# EAGLE design pre3-auto (EAGLE 5.10)
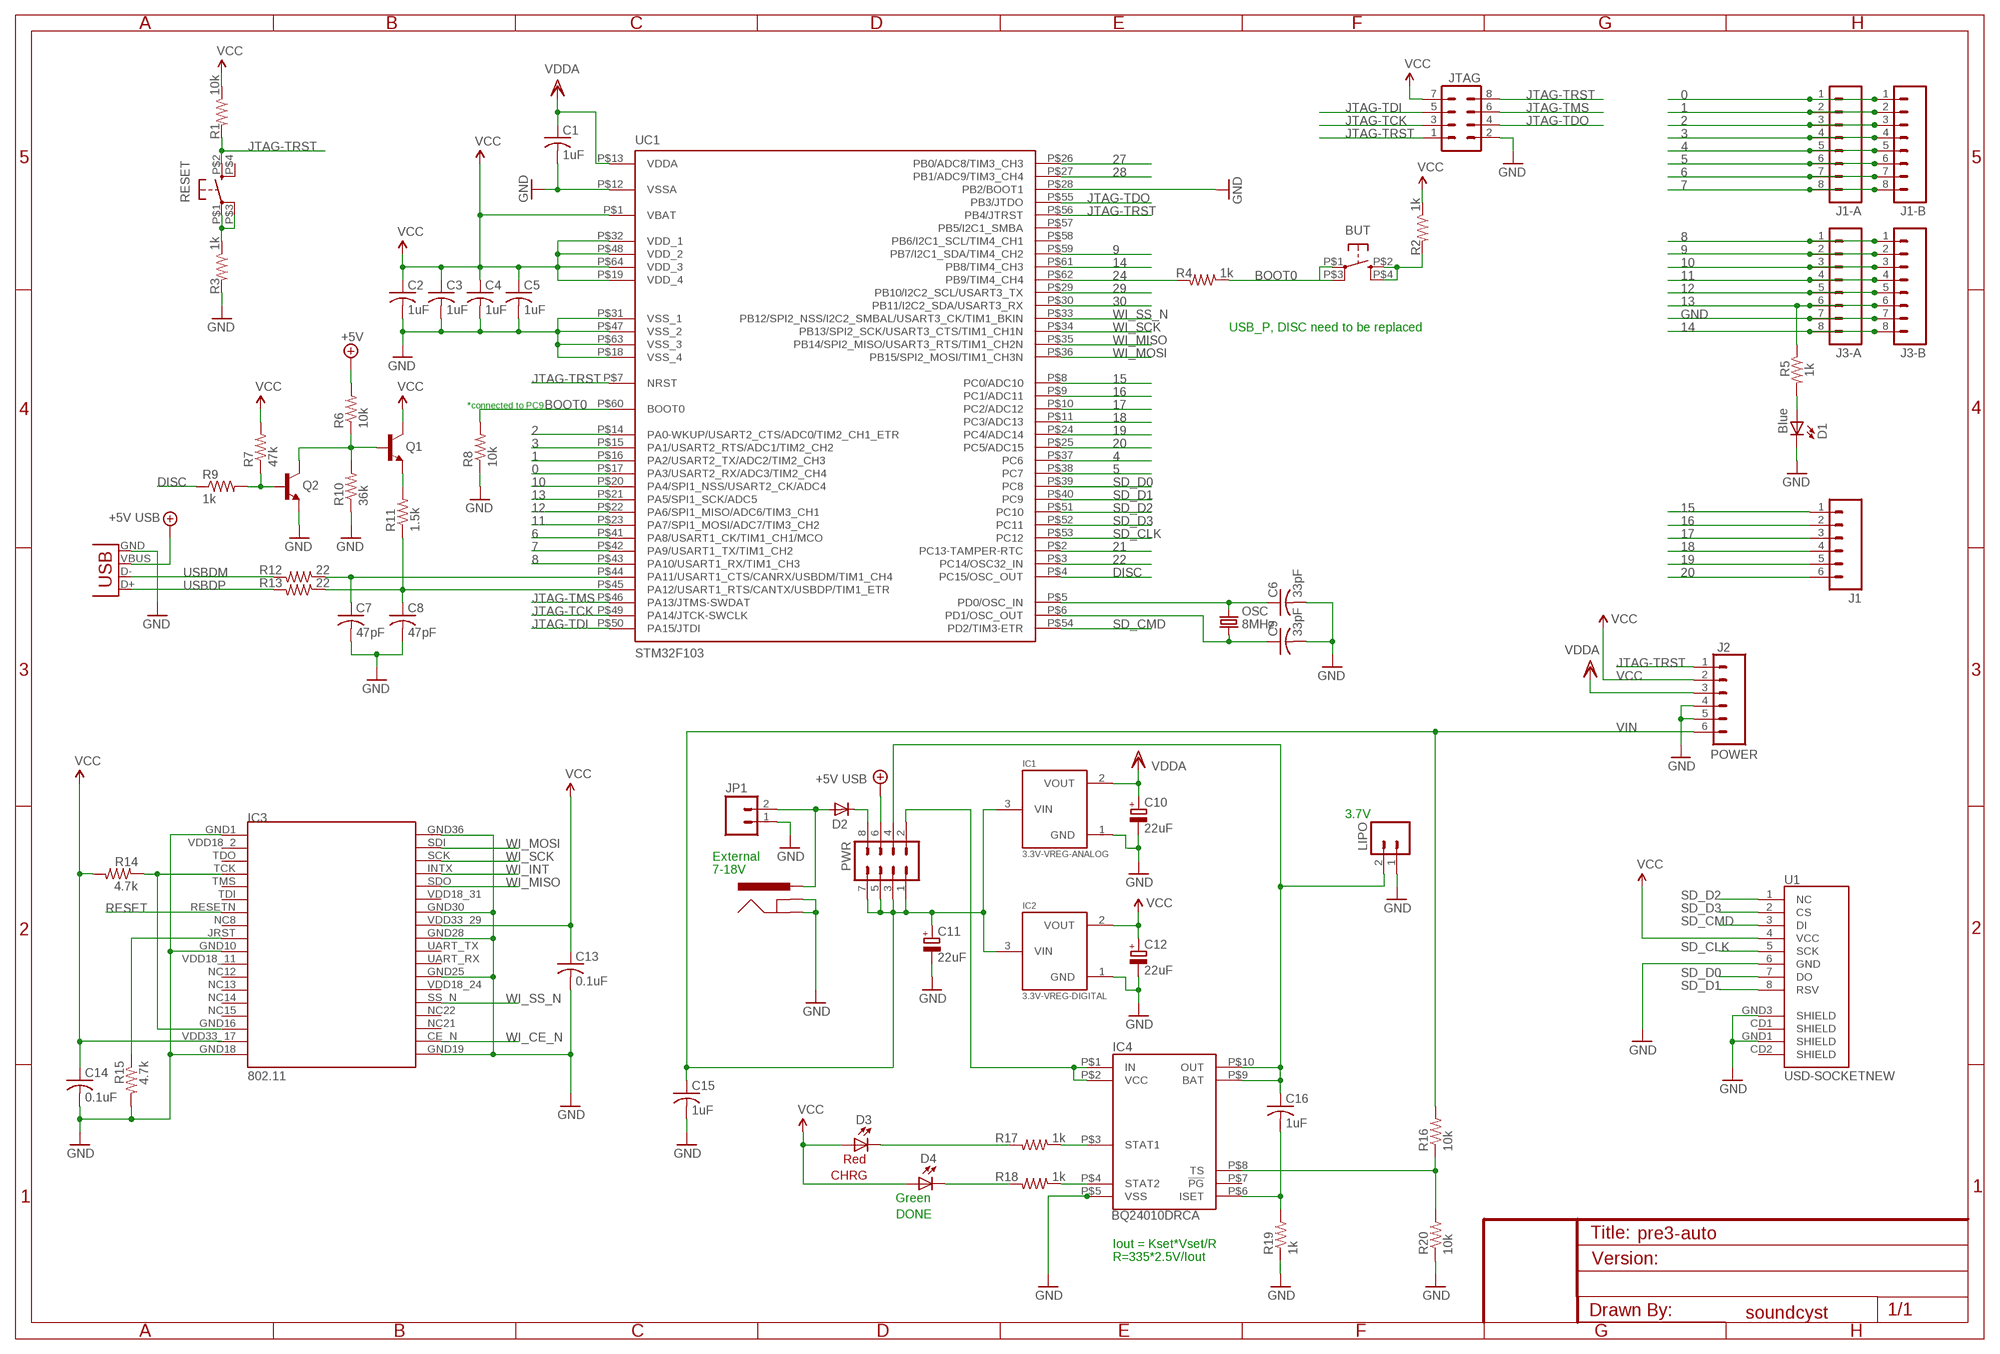
[diagram p0: schematic, sheet 1]

## Parts
BAR  POWER_JACKPTH  [POWER_JACK_PTH]
BUT  BUTTON-KMR241GLFS  [PUSHBUTTON-KMR241GLFS]
C1  1uF  C  [C0603]
C2  1uF  C  [C0603]
C3  1uF  C  [C0603]
C4  1uF  C  [C0603]
C5  1uF  C  [C0603]
C6  33pF  C  [C0603]
C7  47pF  C  [C0603]
C8  47pF  C  [C0603]
C9  33pF  C  [C0603]
C10  22uF  CPOL-EUUD-4X5,8  [UD-4X5,8_NICHICON]
C11  22uF  CPOL-EUUD-4X5,8  [UD-4X5,8_NICHICON]
C12  22uF  CPOL-EUUD-4X5,8  [UD-4X5,8_NICHICON]
C13  0.1uF  C  [C0603]
C14  0.1uF  C  [C0603]
C15  1uF  C  [C0603]
C16  1uF  C  [C0603]
D1  Blue  LED0603  [LED-0603]
D2  DIODE-SOD323-W  [SOD323-W]
D3  Red  LED0603  [LED-0603]
D4  Green  LED0603  [LED-0603]
IC1  3.3V-VREG-ANALOG  MCP1700T  [SOT23]
IC2  3.3V-VREG-DIGITAL  MCP1700T  [SOT23]
IC3  802.11  ZG2100MOD  [ZG2100MOD]
IC4  BQ24010DRCA  [PSON10-V2]
J1  M06SIP  [1X06]
J1-A  M08  [1X08]
J1-B  MA08-SQUARE  [1X08-SQUARE]
J2  POWER  M06SIP  [1X06]
J3-A  M08  [1X08]
J3-B  MA08-SQUARE  [1X08-SQUARE]
JP1  M02PTH  [1X02]
JTAG  MA04-2  [MA04-2]
LIPO  LiPo  M02-JST-2MM-SMT  [S2B-PH]
OSC  8MHz  CRYSTAL5X3  [CRYSTAL-SMD-5X3]
PWR  MA04-2  [MA04-2]
Q1  TRANSISTOR_NPNSOT23  [SOT23]
Q2  TRANSISTOR_NPNSOT23  [SOT23]
R1  10k  R  [R0603]
R2  1k  R  [R0603]
R3  1k  R  [R0603]
R4  1k  R  [R0603]
R5  1k  R  [R0603]
R6  10k  R  [R0603]
R7  47k  R  [R0603]
R8  10k  R  [R0603]
R9  1k  R  [R0603]
R10  36k  R  [R0603]
R11  1.5k  R  [R0603]
R12  22  R  [R0603]
R13  22  R  [R0603]
R14  4.7k  R  [R0603]
R15  4.7k  R  [R0603]
R16  10k  R  [R0603]
R17  1k  R  [R0603]
R18  1k  R  [R0603]
R19  1k  R  [R0603]
R20  10k  R  [R0603]
RESET  BUTTON-KMR241GLFS  [PUSHBUTTON-KMR241GLFS]
U1  USD-SOCKETNEW  [MICRO-SD-SOCKET-PP]
UC1  STM32F103  [TQFP-10X10-64]
X1  USBSMD  [USB-MINIB]

## Nets
0: J1-A.1 J1-B.1 UC1.P$17(PA3/USART2_RX/ADC3/TIM2_CH4)
1: J1-A.2 J1-B.2 UC1.P$16(PA2/USART2_TX/ADC2/TIM2_CH3)
2: J1-A.3 J1-B.3 UC1.P$14(PA0-WKUP/USART2_CTS/ADC0/TIM2_CH1_ETR)
3: J1-A.4 J1-B.4 UC1.P$15(PA1/USART2_RTS/ADC1/TIM2_CH2)
4: J1-A.5 J1-B.5 UC1.P$37(PC6)
5: J1-A.6 J1-B.6 UC1.P$38(PC7)
6: J1-A.7 J1-B.7 UC1.P$41(PA8/USART1_CK/TIM1_CH1/MCO)
7: J1-A.8 J1-B.8 UC1.P$42(PA9/USART1_TX/TIM1_CH2)
8: J3-A.1 J3-B.1 UC1.P$43(PA10/USART1_RX/TIM1_CH3)
9: J3-A.2 J3-B.2 UC1.P$59(PB7/I2C1_SDA/TIM4_CH2)
10: J3-A.3 J3-B.3 UC1.P$20(PA4/SPI1_NSS/USART2_CK/ADC4)
11: J3-A.4 J3-B.4 UC1.P$23(PA7/SPI1_MOSI/ADC7/TIM3_CH2)
12: J3-A.5 J3-B.5 UC1.P$22(PA6/SPI1_MISO/ADC6/TIM3_CH1)
13: J3-A.6 J3-B.6 R5.1 UC1.P$21(PA5/SPI1_SCK/ADC5)
14: J3-A.8 J3-B.8 UC1.P$61(PB8/TIM4_CH3)
15: J1.1 UC1.P$8(PC0/ADC10)
16: J1.2 UC1.P$9(PC1/ADC11)
17: J1.3 UC1.P$10(PC2/ADC12)
18: J1.4 UC1.P$11(PC3/ADC13)
19: J1.5 UC1.P$24(PC4/ADC14)
20: J1.6 UC1.P$25(PC5/ADC15)
21: UC1.P$2(PC13-TAMPER-RTC)
22: UC1.P$3(PC14/OSC32_IN)
24: R4.2 UC1.P$62(PB9/TIM4_CH4)
27: UC1.P$26(PB0/ADC8/TIM3_CH3)
28: UC1.P$27(PB1/ADC9/TIM3_CH4)
29: UC1.P$29(PB10/I2C2_SCL/USART3_TX)
30: UC1.P$30(PB11/I2C2_SDA/USART3_RX)
+5V: PWR.6 R6.2 X1.VBUS ; supply symbol labelled +5V USB
BOOT0: BUT.P$1 BUT.P$3 R4.1 R8.2 UC1.P$60(BOOT0)
DISC: R9.1 UC1.P$4(PC15/OSC_OUT)
GND [vcc]: BAR.GND BAR.GNDBREAK C1.2 C2.2 C3.2 C4.2 C5.2 C6.2 C7.2 C8.2 C9.2 C10.- C11.- C12.- C13.2 C14.2 C15.2 D1.C IC1.1(GND) IC2.1(GND) IC3.GND1 IC3.GND10 IC3.GND18 IC3.GND19 IC3.GND25 IC3.GND28 IC3.GND30 IC3.GND36 IC4.P$5(VSS) J2.4 J2.5 J3-A.7 J3-B.7 JP1.1 JTAG.2 LIPO.1 Q2.2(E) R3.2 R8.1 R10.1 R15.2 R19.1 R20.1 U1.6(GND) U1.GND1(SHIELD) U1.GND3(SHIELD) UC1.P$12(VSSA) UC1.P$18(VSS_4) UC1.P$28(PB2/BOOT1) UC1.P$31(VSS_1) UC1.P$47(VSS_2) UC1.P$63(VSS_3) X1.GND
JTAG-TCK: JTAG.3 UC1.P$49(PA14/JTCK-SWCLK)
JTAG-TDI: JTAG.5 UC1.P$50(PA15/JTDI)
JTAG-TDO: JTAG.4 UC1.P$55(PB3/JTDO)
JTAG-TMS: JTAG.6 UC1.P$46(PA13/JTMS-SWDAT)
JTAG-TRST: J2.1 JTAG.1 JTAG.8 R1.2 RESET.P$2 UC1.P$7(NRST) UC1.P$56(PB4/JTRST)
N$1 [vcc]: BAR.PWR D2.A JP1.2
N$2: C9.1 OSC.1 UC1.P$6(PD1/OSC_OUT)
N$3: IC4.P$8(TS) R16.1 R20.2
N$5: D2.C PWR.8
N$6: C6.1 OSC.3 UC1.P$5(PD0/OSC_IN)
N$7: D1.A R5.2
N$8: Q1.2(E) R11.2
N$9: Q1.1(B) Q2.3(C) R6.1 R10.2
N$10: Q2.1(B) R7.1 R9.2
N$11: C7.1 R12.1 UC1.P$44(PA11/USART1_CTS/CANRX/USBDM/TIM1_CH4)
N$12: C8.1 R11.1 R13.1 UC1.P$45(PA12/USART1_RTS/CANTX/USBDP/TIM1_ETR)
N$13: IC4.P$1(IN) IC4.P$2(VCC) PWR.2
N$16 [vcc]: C16.1 IC4.P$9(BAT) IC4.P$10(OUT) LIPO.2 PWR.4
N$18: IC3.GND16 IC3.TCK R14.1
N$19: C16.2 IC4.P$6(ISET) R19.2
N$20: D4.C R18.2
N$21: D3.C R17.2
N$22: IC4.P$3(STAT1) R17.1
N$23: IC4.P$4(STAT2) R18.1
N$25 [vcc]: R3.1 RESET.P$1 RESET.P$3
N$26: BUT.P$2 BUT.P$4 R2.2
N$27: IC3.JRST R15.1
RESET: IC3.RESETN(RSTN)
SD_CLK: U1.5(SCK) UC1.P$53(PC12)
SD_CMD: U1.3(DI) UC1.P$54(PD2/TIM3-ETR)
SD_D0: U1.7(DO) UC1.P$39(PC8)
SD_D1: U1.8(RSV) UC1.P$40(PC9)
SD_D2: U1.1(NC) UC1.P$51(PC10)
SD_D3: U1.2(CS) UC1.P$52(PC11)
USBDM: R12.2 X1.D-
USBDP: R13.2 X1.D+
VCC: C2.1 C3.1 C4.1 C5.1 C12.+ C13.1 C14.1 D3.A D4.A IC2.2(VOUT) IC3.VDD33_17 IC3.VDD33_29 J2.2 JTAG.7 Q1.3(C) R1.1 R2.1 R7.2 R14.2 U1.4(VCC) UC1.P$1(VBAT) UC1.P$19(VDD_4) UC1.P$32(VDD_1) UC1.P$48(VDD_2) UC1.P$64(VDD_3)
VDD: C1.1 C10.+ IC1.2(VOUT) J2.3 UC1.P$13(VDDA) ; supply symbol labelled VDDA
VIN: C11.+ C15.1 IC1.3(VIN) IC2.3(VIN) J2.6 PWR.1 PWR.3 PWR.5 PWR.7 R16.2
WI_CE_N: IC3.CE_N
WI_INT: IC3.INTX
WI_MISO: IC3.SDO UC1.P$35(PB14/SPI2_MISO/USART3_RTS/TIM1_CH2N)
WI_MOSI: IC3.SDI UC1.P$36(PB15/SPI2_MOSI/TIM1_CH3N)
WI_SCK: IC3.SCK UC1.P$34(PB13/SPI2_SCK/USART3_CTS/TIM1_CH1N)
WI_SS_N: IC3.SS_N UC1.P$33(PB12/SPI2_NSS/I2C2_SMBAL/USART3_CK/TIM1_BKIN)
Unconnected: IC3.NC8 IC3.NC12 IC3.NC13 IC3.NC14 IC3.NC15 IC3.NC21 IC3.NC22 IC3.TDI IC3.TDO IC3.TMS IC3.UART_RX IC3.UART_TX IC3.VDD18_2 IC3.VDD18_11 IC3.VDD18_24 IC3.VDD18_31 IC4.P$7(!PG) RESET.P$4 U1.CD1(SHIELD) U1.CD2(SHIELD) UC1.P$57(PB5/I2C1_SMBA) UC1.P$58(PB6/I2C1_SCL/TIM4_CH1)

## Notes on the sheet
- USB_P, DISC need to be replaced
- *connected to PC9
- 3.7V
- External
- 7-18V
- CHRG
- DONE
- Iout = Kset*Vset/R
- R=335*2.5V/Iout
- soundcyst

## Library data of the parts
BAR = SparkFun2:POWER_JACK: Power Jack This is the standard 5.5mm barrel jack for power. The PTH is the most common, proven, reliable, footprint. All others are experimental. The Slot footprint only works if the mill layer is transmitted to the PCB fab house so be warned. Spark Fun Electronics SKU : PRT-00119. Mating wall wart : TOL-00298 (and others)
BUT RESET = okie:BUTTON-KMR241GLFS
C1-C9 C13-C16 = ReplenishComponentLib:C
C10-C12 = rcl:CPOL-EU: POLARIZED CAPACITOR, European symbol
D1 D3 D4 = SparkFun:LED: LEDs Standard schematic elements and footprints for 5mm, 3mm, 1206, and 0603 sized LEDs. 5mm - Spark Fun Electronics SKU : COM-00529 (and others)
D2 = diode:DIODE-: DIODE
IC1 IC2 = okie:MCP1700T
IC3 = ZGLIB:ZG2100MOD: ZG2100 Module
IC4 = xkn_lib:BQ24010DRC
J1 J2 = SparkFun:M06: Header 6 Standard 6-pin 0.1" header. Use with straight break away headers (SKU : PRT-00116), right angle break away headers (PRT-00553), swiss pins (PRT-00743), machine pins (PRT-00117), and female headers (PRT-00115). Molex polarized connector foot print use with SKU : PRT-08094 with associated crimp pins and housings.
J1-A J3-A = SparkFun:M08: Header 8 Standard 8-pin 0.1" header. Use with straight break away headers (SKU : PRT-00116), right angle break away headers (PRT-00553), swiss pins (PRT-00743), machine pins (PRT-00117), and female headers (PRT-00115).
J1-B J3-B = SparkFun2:MA08-SQUARE
JP1 = SparkFun2:M02: Header 2 Standard 2-pin 0.1" header. Use with straight break away headers (SKU : PRT-00116), right angle break away headers (PRT-00553), swiss pins (PRT-00743), machine pins (PRT-00117), and female headers (PRT-00115). Molex polarized connector foot print use with SKU : PRT-08233 with associated crimp pins and housings.
JTAG PWR = con-lstb:MA04-2: PIN HEADER
LIPO = SparkFun:M02: Header 2 Standard 2-pin 0.1" header. Use with straight break away headers (SKU : PRT-00116), right angle break away headers (PRT-00553), swiss pins (PRT-00743), machine pins (PRT-00117), and female headers (PRT-00115). Molex polarized connector foot print use with SKU : PRT-08233 with associated crimp pins and housings.
OSC = SparkFun2:CRYSTAL: Crystals Various standard crystals. Proven footprints. Spark Fun Electronics SKU : COM-00534
Q1 Q2 = SparkFun2:TRANSISTOR_NPN: Transistor NPN BJT configuration in SOT23 package. MMBT2222 is the common NPN we use. Double check BCE configuration again layout.
R1-R20 = ReplenishComponentLib:R
U1 = SparkFun:USD-SOCKET: microSD Socket Push-push type uSD socket. Schematic element and footprint production proven. Spark Fun Electronics SKU : PRT-00127. tDoc lines correctly indicate media card edge positions when inserting (unlocked, locked, depressed).
UC1 = st-microelectronics:STM32F103
X1 = SparkFun2:USB: USB Connectors USB-B-PTH is fully proven SKU : PRT-00139 USB-miniB is fully proven SKU : PRT-00587 USB-A-PCB is untested. USB-A-H is throughly reviewed, but untested. Spark Fun Electronics SKU : PRT-00437 USB-B-SMT is throughly reviewed, but untested. Needs silkscreen touching up. USB-A-S has not been used/tested USB-MB-H has not been used/tested

## Net classes
0 default: width 0.203 mm, clearance 0.152 mm
1 vcc: width 0.254 mm, clearance 0.152 mm
2 gnd: width 0.305 mm, drill 0.508 mm, clearance 0.152 mm
3 usbvcc: width 0.508 mm, drill 0.508 mm, clearance 0.152 mm

## Board
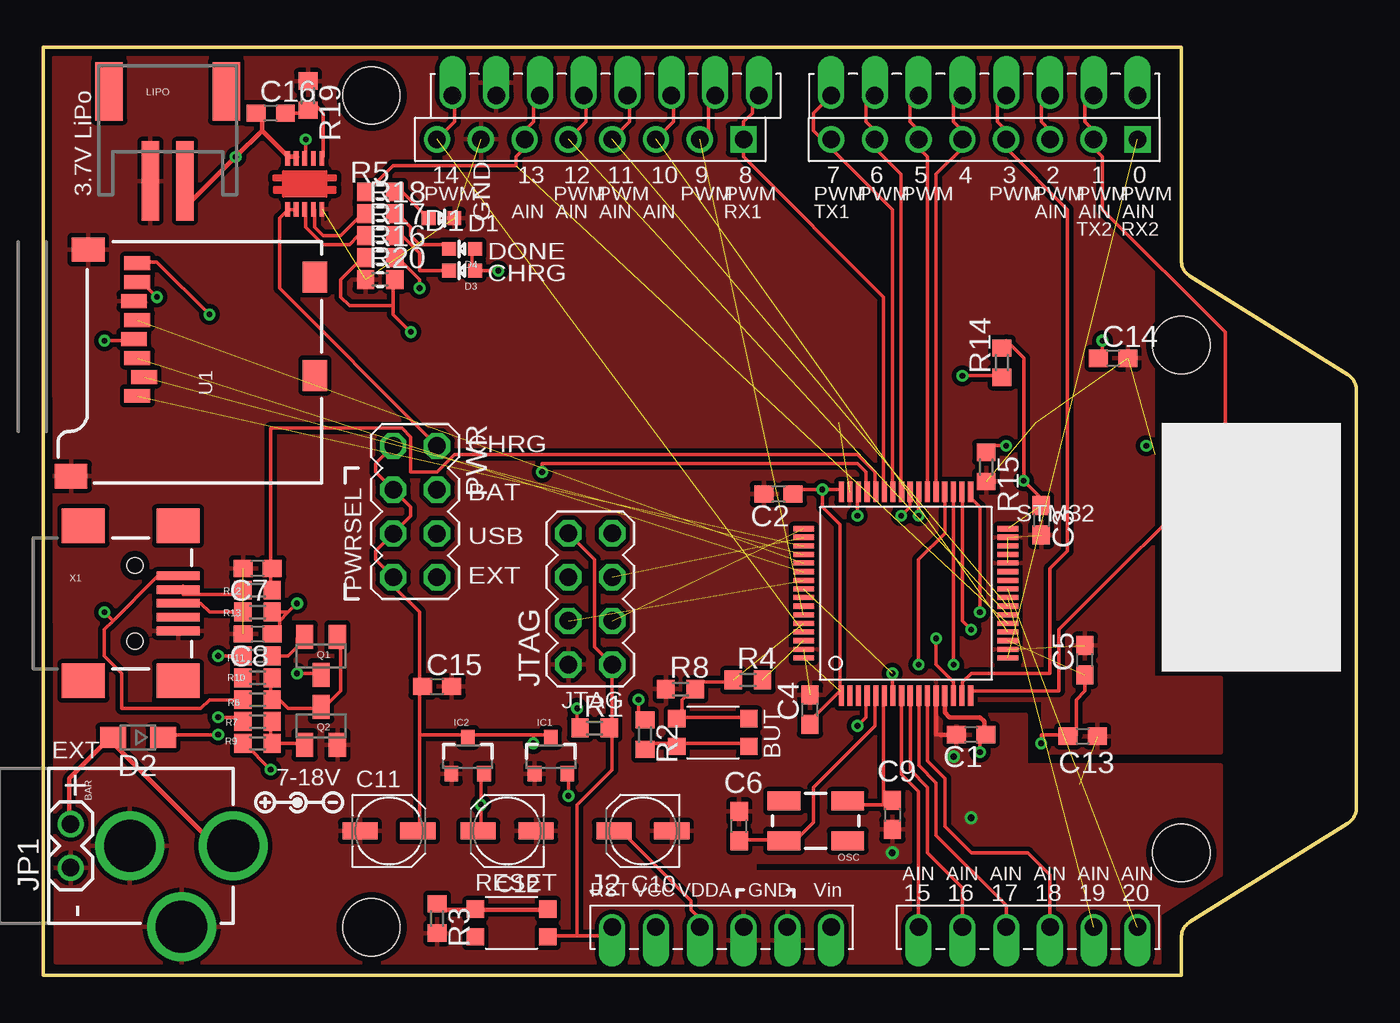
[diagram p1: board, top side]
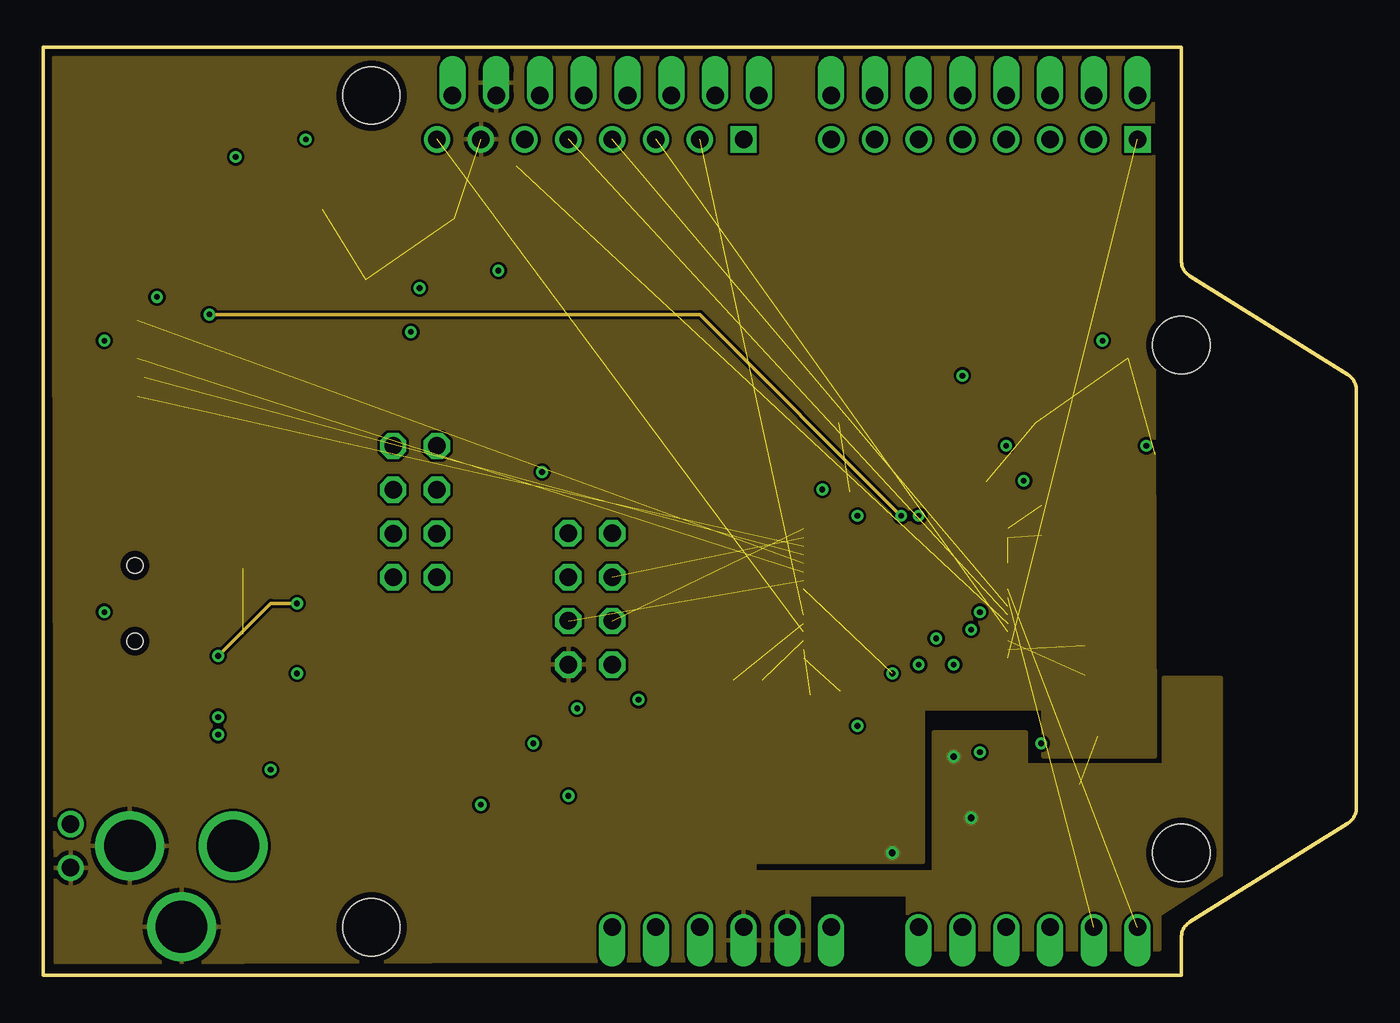
[diagram p2: board, inner layer gndplane]
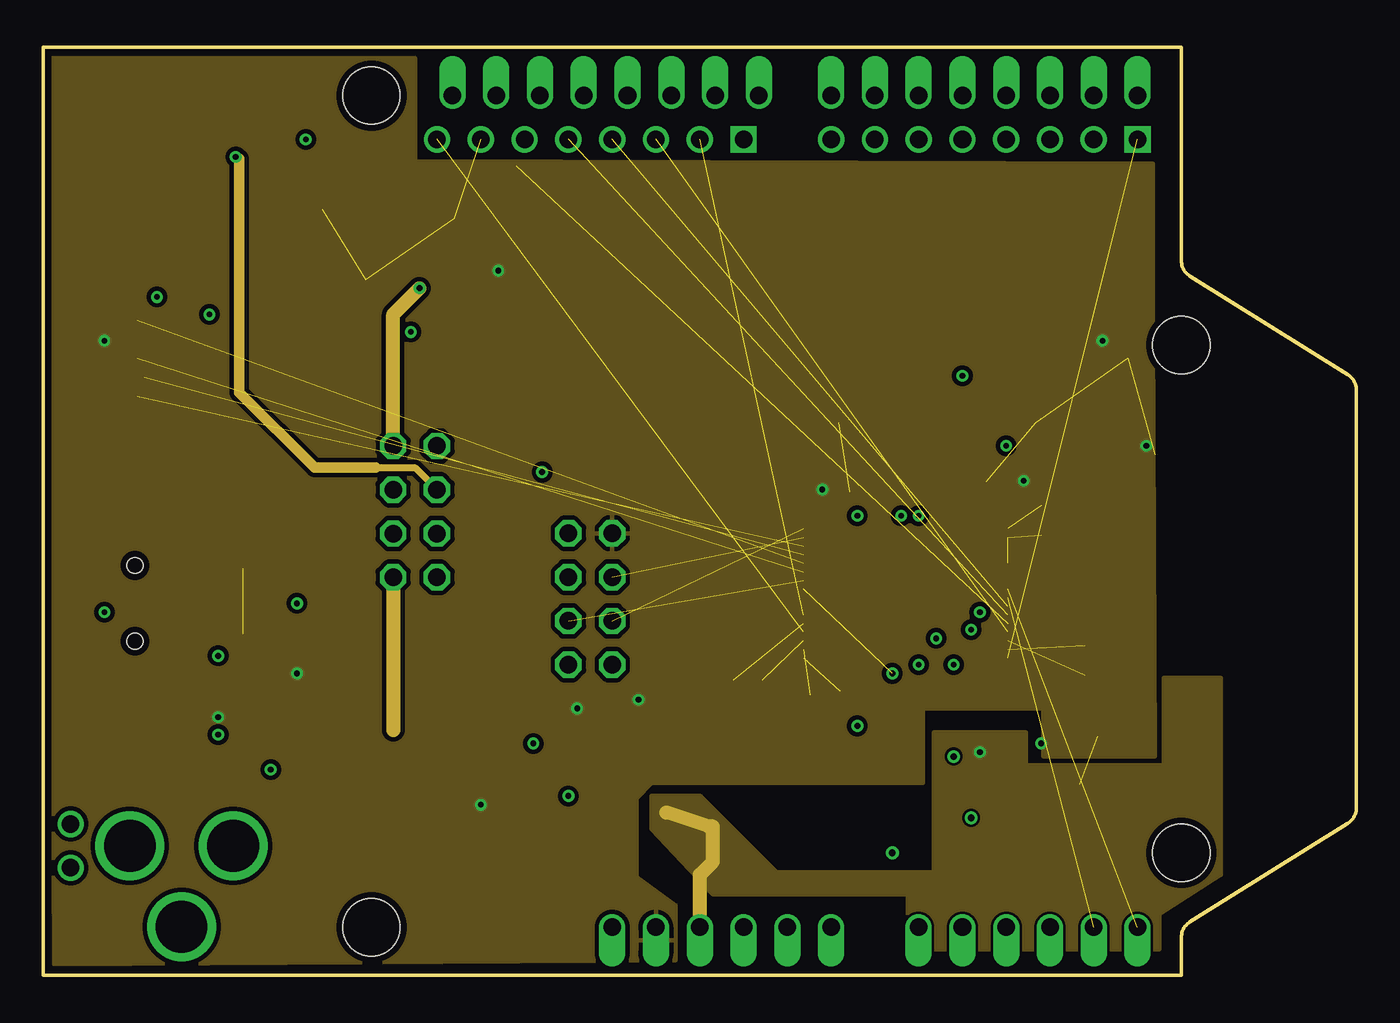
[diagram p3: board, inner layer Route15]
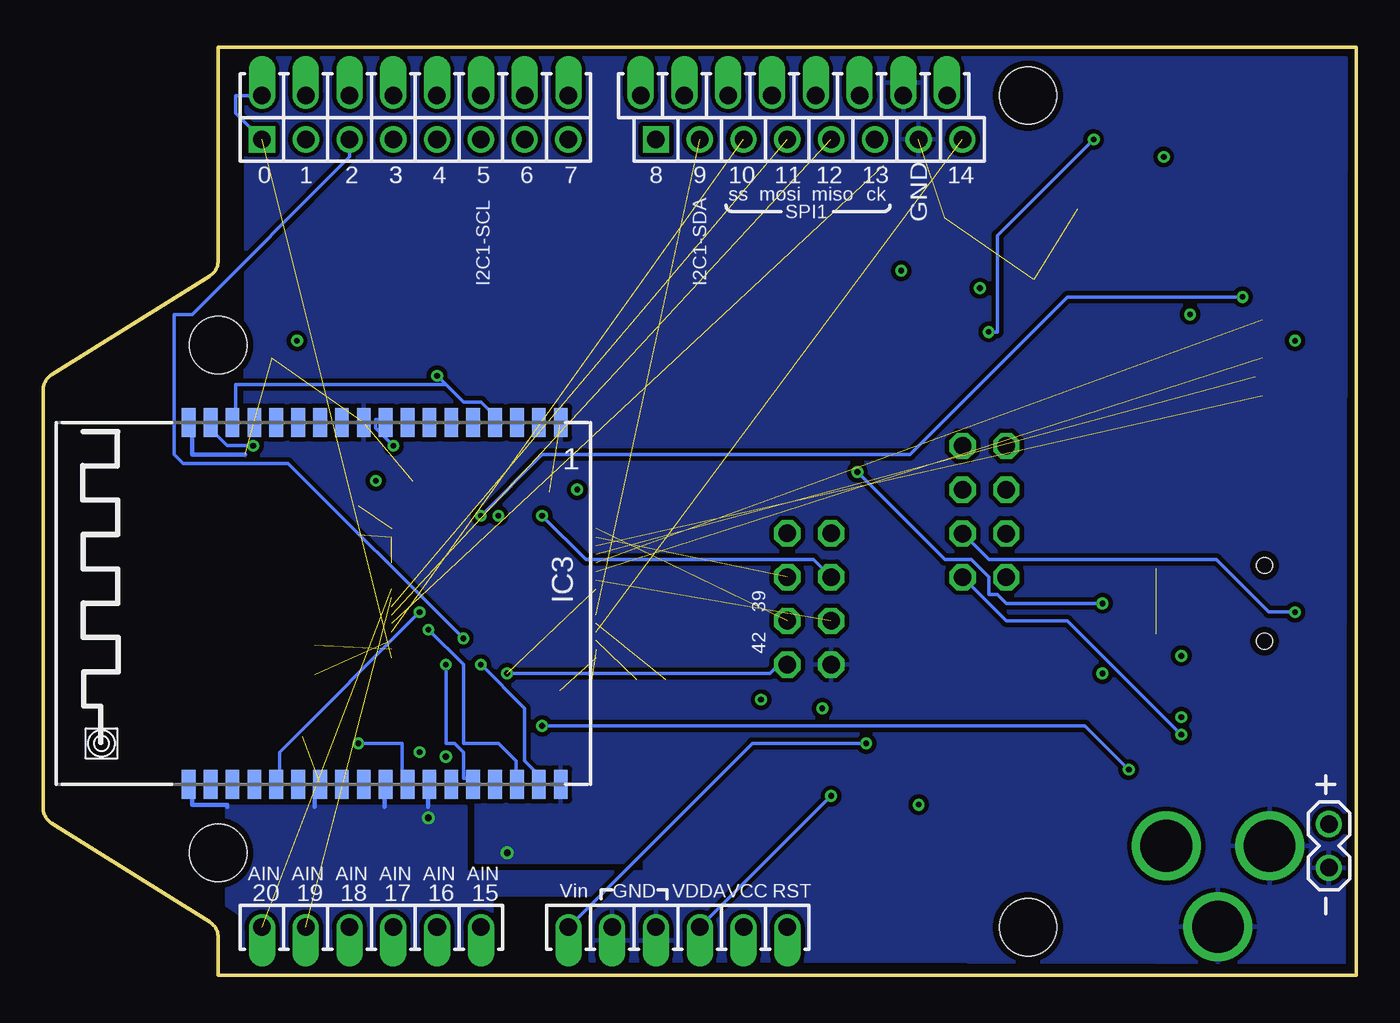
[diagram p4: board, bottom side, seen from below]

Size 76.2 x 53.85 mm. Coordinates in mm from the lower left corner, seen from the top.
Outline: 75.69,8.83 arc58 76.2,9.74 76.2,33.95 arc58 75.69,34.86 66.55,40.58 arc-58 66.04,41.49 66.04,53.85 0,53.85 0,0 66.04,0 66.04,2.2 arc-58 66.55,3.11 75.69,8.83
Copper layers (1*2*15*16): Top 0.0356mm / dielectric 1.5011mm / gndplane 0.0356mm / dielectric 0.1499mm / Route15 0.0356mm / dielectric 0.2007mm / Bottom 0.0356mm
Design rules "LaenPCBOrder *": minimum track width 6mil, minimum drill 13mil, track to track 6mil, track to pad 6mil, pad to pad 6mil, via to via 6mil, smd to smd 6mil, copper to edge 15mil, drill to drill 6mil, minimum pad ring 7mil, minimum via ring 7mil, stop-mask expansion 4mil, vias tented up to drill 0mil, thermal gap 10mil

### Footprints (pad centres in the part's own frame; a part is rotated, then mirrored left to right if it is on the bottom)
POWER_JACK_PTH = drill 2.997 round: GND 0,7.7; GNDBREAK 4.7,10.7; PWR 0,13.7
PUSHBUTTON-KMR241GLFS = smd 1 x 1: P$1 2.1,0.8; P$2 2.1,-0.8; P$3 -2.1,0.8; P$4 -2.1,-0.8
C0603 = smd 1.1 x 1: 1 -0.85,0; 2 0.85,0
UD-4X5,8_NICHICON = smd 2.032 x 1: + 1.679,0; - -1.679,0
LED-0603 = smd 0.8 x 0.8: A 0,-0.75; C 0,0.75
SOD323-W = smd 1.5 x 1.2: A 1.45,0; C -1.45,0
SOT23 = smd 0.8 x 0.9: 1 -0.95,-1; 2 0.95,-1; 3 0,1.1
ZG2100MOD = smd 0.8 x 1.7: CE_N 6.63,10.12; GND1 -13.69,-10.88; GND10 -2.26,-10.88; GND16 5.36,-10.88; GND18 7.9,-10.88; GND19 7.9,10.12; GND25 0.28,10.12; GND28 -3.53,10.12; GND30 -6.07,10.12; GND36 -13.69,10.12; INTX -9.88,10.12; JRST -3.53,-10.88; NC8 -4.8,-10.88; NC12 0.28,-10.88; NC13 1.55,-10.88; NC14 2.82,-10.88; NC15 4.09,-10.88; NC21 5.36,10.12; NC22 4.09,10.12; RESETN -6.07,-10.88; SCK -11.15,10.12; SDI -12.42,10.12; SDO -8.61,10.12; SS_N 2.82,10.12; TCK -9.88,-10.88; TDI -7.34,-10.88; TDO -11.15,-10.88; TMS -8.61,-10.88; UART_RX -0.99,10.12; UART_TX -2.26,10.12; VDD18_2 -12.42,-10.88; VDD18_11 -0.99,-10.88; VDD18_24 1.55,10.12; VDD18_31 -7.34,10.12; VDD33_17 6.63,-10.88; VDD33_29 -4.8,10.12
PSON10-V2 = smd 0.85 x 0.28: P$1 -1.475,1; P$2 -1.475,0.5; P$3 -1.475,0; P$4 -1.475,-0.5; P$5 -1.475,-1; P$6 1.475,-1; P$7 1.475,-0.5; P$8 1.475,0; P$9 1.475,0.5; P$10 1.475,1
1X06 = drill 1.016 offset: 1 0,0; 2 2.54,0; 3 5.08,0; 4 7.62,0; 5 10.16,0; 6 12.7,0
1X08 = drill 1.016 offset: 1 0,0; 2 2.54,0; 3 5.08,0; 4 7.62,0; 5 10.16,0; 6 12.7,0; 7 15.24,0; 8 17.78,0
1X08-SQUARE = drill 1.016 square: 1 -8.89,0 | drill 1.016 round: 2 -6.35,0; 3 -3.81,0; 4 -1.27,0; 5 1.27,0; 6 3.81,0; 7 6.35,0; 8 8.89,0
1X02 = drill 1.016 round: 1 0,0; 2 2.54,0
MA04-2 = drill 1.016 octagon: 1 -3.81,-1.27; 2 -3.81,1.27; 3 -1.27,-1.27; 4 -1.27,1.27; 5 1.27,-1.27; 6 1.27,1.27; 7 3.81,-1.27; 8 3.81,1.27
S2B-PH = smd 1 x 4.6: 1 -1,-3.7; 2 1,-3.7 | smd 1.6 x 3.4: NC1 -3.4,1.5; NC2 3.4,1.5
CRYSTAL-SMD-5X3 = smd 1.9 x 1.1: 1 -1.85,-1.15; 2 1.85,-1.15; 3 1.85,1.15; 4 -1.85,1.15
SOT23' = smd 1 x 1.4: 1 -0.95,-1.1; 2 0.95,-1.1; 3 0,1.1
R0603 = smd 1 x 1.1: 1 -0.85,0; 2 0.85,0
MICRO-SD-SOCKET-PP = smd 0.8 x 1.5: 1 -8.94,10.7; 2 -7.84,10.3; 3 -6.74,10.7; 4 -5.64,10.9; 5 -4.54,10.7; 6 -3.44,10.9; 7 -2.34,10.7; 8 -1.24,10.7 | smd 1.8 x 1.4: CD1 -2.05,0.4; CD2 -7.75,0.4 | smd 1.4 x 1.9: GND1 -13.6,14.55; GND3 -0.45,13.55
STAND-OFF = hole 3.302: 0,0
TQFP-10X10-64 = smd 1.2 x 0.3: P$1 -5.936,3.75; P$2 -5.936,3.25; P$3 -5.936,2.75; P$4 -5.936,2.25; P$5 -5.936,1.75; P$6 -5.936,1.25; P$7 -5.936,0.75; P$8 -5.936,0.25; P$9 -5.936,-0.25; P$10 -5.936,-0.75; P$11 -5.936,-1.25; P$12 -5.936,-1.75; P$13 -5.936,-2.25; P$14 -5.936,-2.75; P$15 -5.936,-3.25; P$16 -5.936,-3.75; P$33 5.886,-3.75; P$34 5.886,-3.25; P$35 5.886,-2.75; P$36 5.886,-2.25; P$37 5.886,-1.75; P$38 5.886,-1.25; P$39 5.886,-0.75; P$40 5.886,-0.25; P$41 5.886,0.25; P$42 5.886,0.75; P$43 5.886,1.25; P$44 5.886,1.75; P$45 5.886,2.25; P$46 5.886,2.75; P$47 5.886,3.25; P$48 5.886,3.75 | smd 0.3 x 1.2: P$17 -3.75,-5.911; P$18 -3.25,-5.911; P$19 -2.75,-5.911; P$20 -2.25,-5.911; P$21 -1.75,-5.911; P$22 -1.25,-5.911; P$23 -0.75,-5.911; P$24 -0.25,-5.911; P$25 0.25,-5.911; P$26 0.75,-5.911; P$27 1.25,-5.911; P$28 1.75,-5.911; P$29 2.25,-5.911; P$30 2.75,-5.911; P$31 3.25,-5.911; P$32 3.75,-5.911; P$49 3.75,5.936; P$50 3.25,5.936; P$51 2.75,5.936; P$52 2.25,5.936; P$53 1.75,5.936; P$54 1.25,5.936; P$55 0.75,5.936; P$56 0.25,5.936; P$57 -0.25,5.936; P$58 -0.75,5.936; P$59 -1.25,5.936; P$60 -1.75,5.936; P$61 -2.25,5.936; P$62 -2.75,5.936; P$63 -3.25,5.936; P$64 -3.75,5.936
USB-MINIB = smd 2.5 x 0.5: D+ 2.5,0; D- 2.5,0.8; GND 2.5,-1.6; ID 2.5,-0.8; VBUS 2.5,1.6 | smd 2.5 x 2: GND@1 -3,-4.5; GND@2 -3,4.5; GND@3 2.5,4.5; GND@4 2.5,-4.5 | hole 0.9: 0,2.2; 0,-2.2

### Placement (x,y rotation side)
BAR  -2.67,7.52 270 top
BUT  38.86,14.1 0 top
C1  53.85,13.97 180 top
C2  42.67,27.94 180 top
C3  57.91,26.42 270 top
C4  44.5,15.42 90 top
C5  60.45,18.29 90 top
C6  40.39,8.66 90 top
C7  12.45,23.62 180 top
C8  12.45,19.81 180 top
C9  49.28,9.32 270 top
C10  34.8,8.38 180 top
C11  20.07,8.38 0 top
C12  26.92,8.38 180 top
C13  60.31,13.88 0 top
C14  62.08,35.81 0 top
C15  22.86,16.76 0 top
C16  13.21,50.04 0 top
D1  23.11,43.94 270 top
D2  5.51,13.82 180 top
D3  24.31,40.89 90 top
D4  24.31,42.16 90 top
IC1  29.46,12.7 0 top
IC2  24.64,12.7 0 top
IC3  59.85,21.21 180 bottom
IC4  15.18,45.93 90 top
J1  50.8,2.79 0 top
J1-A  63.5,51.05 180 top
J1-B  54.61,48.51 180 top
J2  33.02,2.79 0 top
J3-A  41.53,51.05 180 top
J3-B  31.75,48.51 180 top
JP1  1.6,6.25 90 top
JTAG  31.75,21.84 90 top
LIPO  7.23,49.8 0 top
OSC  44.83,8.97 180 top
PWR  21.58,26.91 270 top
Q1  [SOT23']  16.13,18.54 180 top
Q2  [SOT23']  16.13,14.48 0 top
R1  32,14.35 0 top
R2  34.92,13.97 270 top
R3  22.86,3.3 270 top
R4  40.89,17.14 0 top
R5  19.56,45.47 0 top
R6  12.45,16 180 top
R7  12.45,14.73 180 top
R8  36.98,16.61 0 top
R9  12.45,13.46 0 top
R10  12.45,17.27 0 top
R11  12.45,18.54 0 top
R12  12.45,22.35 180 top
R13  12.45,21.08 180 top
R14  55.63,35.56 90 top
R15  54.72,29.51 270 top
R16  19.56,41.66 0 top
R17  19.56,42.93 0 top
R18  19.56,44.2 0 top
R19  15.37,51.05 270 top
R20  19.56,40.39 0 top
RESET  27.18,3.05 0 top
U1  16.17,42.57 90 top
U$1  STAND-OFF  [STAND-OFF]  19.05,2.79 0 top
U$2  STAND-OFF  [STAND-OFF]  66.04,36.58 0 top
U$4  STAND-OFF  [STAND-OFF]  19.05,51.05 0 top
U$10  STAND-OFF  [STAND-OFF]  66.04,7.11 0 top
UC1  50.06,22.17 90 top
X1  5.33,21.59 0 top

### Tracks (layer width: path | path; a pad name or v marks a point on that pad's centre or on a via)
0  (1 unrouted)
  Bottom 0.203: J1-B.1 65.02,50.04 65.02,51.05 J1-A.1
1
  Top 0.203: UC1.P$16 53.85,16.51 58.93,16.51 58.93,20.07 68.58,29.72 68.58,37.34 61.47,44.45 61.47,47.5 60.96,48.01 J1-B.2 60.96,49.02 60.45,49.53 60.45,50.55 J1-A.2
2  (via drill 0.33)
  Top 0.203: v51.82,19.56 51.82,18.03 52.83,17.02 52.83,16.51 UC1.P$14 | J1-A.3 57.91,50.55 57.91,49.53 58.42,49.02 J1-B.3
  Bottom 0.203: v51.82,19.56 61.98,29.72 68.07,29.72 68.58,30.23 68.58,38.35 67.56,38.35 58.42,47.5 J1-B.3
3
  Top 0.203: UC1.P$15 53.34,16.51 53.34,17.02 53.85,17.53 58.42,17.53 58.42,23.62 59.44,24.64 59.44,44.45 55.88,48.01 J1-B.4 55.88,49.02 55.37,49.53 55.37,50.55 J1-A.4
4
  Top 0.203: UC1.P$37 51.82,28.19 51.82,46.48 53.34,48.01 J1-B.5 53.34,49.02 52.83,49.53 52.83,50.55 J1-A.5
5
  Top 0.203: UC1.P$38 51.31,28.19 51.31,47.5 50.8,48.01 J1-B.6 50.8,49.02 50.29,49.53 50.29,50.55 J1-A.6
6
  Top 0.203: UC1.P$41 49.78,28.19 49.78,46.48 48.26,48.01 J1-B.7 48.26,49.02 47.75,49.53 47.75,50.55 J1-A.7
7
  Top 0.203: 45.72,48.01 49.28,44.45 49.28,28.19 UC1.P$42 | J1-A.8 44.7,50.04 44.7,49.02 45.72,48.01 | 45.72,48.01 J1-B.8
8
  Top 0.203: UC1.P$43 48.77,28.19 48.77,39.37 40.64,47.5 J3-B.1 40.64,49.53 41.15,50.04 41.15,51.05 J3-A.1
9  (1 unrouted)
  Top 0.203: J3-B.2 38.61,49.02 38.61,51.05 J3-A.2
10  (1 unrouted)
  Top 0.203: J3-B.3 36.58,49.53 36.58,51.05 J3-A.3
11  (1 unrouted)
  Top 0.203: J3-B.4 34.04,49.53 34.04,51.05 J3-A.4
12  (1 unrouted)
  Top 0.203: J3-B.5 31.5,49.53 31.5,51.05 J3-A.5
13  (1 unrouted)
  Top 0.203: R5.1 18.8,45.47 20.32,46.99 27.43,46.99 27.43,47.5 27.94,48.01 J3-B.6 27.94,49.02 28.45,49.53 28.45,51.05 J3-A.6
14  (1 unrouted)
  Top 0.203: J3-B.8 23.88,49.53 23.88,51.05 J3-A.8
15
  Top 0.203: UC1.P$8 49.81,11.65 50.8,10.67 J1.1
16
  Top 0.203: UC1.P$9 50.31,11.92 51.31,10.92 51.31,7.11 53.34,5.08 J1.2
17
  Top 0.203: UC1.P$10 50.81,12.18 51.82,11.18 51.82,8.13 55.88,4.06 J1.3
18
  Top 0.203: UC1.P$11 51.31,12.44 52.32,11.43 52.32,8.64 53.85,7.11 57.15,7.11 58.42,5.84 J1.4
19  (1 unrouted)
20  (1 unrouted)
24  (1 unrouted)
+5V  (via drill 0.33)
  Top 0.203: 4.06,20.57 6.6,23.11 7.62,23.11 X1.VBUS | 4.06,20.57 3.56,20.07 3.56,18.54 4.57,17.53 4.57,15.49 9.14,15.49 9.65,16 R6.2 | 4.06,20.57 v3.56,21.08
  Bottom 0.203: v3.56,21.08 5.08,21.08 8.13,24.13 21.34,24.13 22.35,25.15 PWR.6
BOOT0  (1 unrouted)
  Top 0.203: 37.08,14.99 37.08,16 37.59,16.51 R8.2 38.1,17.02 39.62,17.02 R4.1 | 37.08,14.99 40.64,14.99 BUT.P$1 | BUT.P$3 37.08,14.99
DISC  (via drill 0.33)
  Top 0.203: v13.21,11.94 11.68,13.46 R9.1 | v47.24,14.48 47.75,14.99 47.75,16 UC1.P$4
  Bottom 0.203: v13.21,11.94 15.75,14.48 v47.24,14.48
GND  (via drill 0.38)  (13 unrouted)
  Top 0.254: UC1.P$12 51.81,13.97 52.07,13.97 C1.2
  Bottom 0.254: IC3.GND30 53.85,10.92 53.85,9.78 | IC3.GND28 56.39,10.92 56.39,9.78 | IC3.GND25 60.45,10.92 60.45,9.78 | IC3.GND19 67.56,10.92 67.56,9.91 65.53,9.91 65.53,9.78 | IC3.GND18 67.56,31.75 67.56,30.23 64.52,30.23 64.46,30.22
  other vias: 49.28,7.11 53.85,9.14 52.83,12.7
  pour gndplane: 0.61,53.21 64.39,53.21 64.52,12.7 58.04,12.7 58.04,15.49 51.05,15.49 51.05,6.6 41.27,6.6 41.27,5.97 51.69,5.97 51.69,14.1 57.02,14.1 57.02,12.19 65.02,12.19 65.02,17.27 68.33,17.27 68.33,5.84 64.77,3.53 64.77,1.52 50.16,1.52 50.16,4.7 44.45,4.7 44.45,0.89 0.74,0.76
  pour Bottom (isolate 0.254): 0.61,53.21 64.39,53.21 64.52,12.95 58.04,12.95 58.04,15.49 51.05,15.49 51.05,6.6 41.27,6.6 41.27,5.97 51.69,5.97 51.69,9.78 65.53,9.78 65.53,4.06 64.77,3.56 64.77,1.52 50.16,1.52 50.16,4.7 44.45,4.7 44.45,0.89 0.74,0.76
  pour Top (isolate 0.254): 0.61,53.21 64.39,53.21 64.39,17.27 68.33,17.27 68.33,12.95 58.04,12.95 58.04,16 49.28,16 49.28,12.45 50.29,11.43 50.29,6.6 41.27,6.6 41.27,5.97 51.69,5.97 51.69,15.11 57.02,15.11 57.02,12.19 68.33,12.19 68.33,5.84 64.77,3.56 64.77,0.74 0.74,0.76
JTAG-TCK  (1 unrouted)
JTAG-TDI  (1 unrouted)
JTAG-TDO  (1 unrouted)
JTAG-TMS  (via drill 0.33)
  Top 0.203: v47.24,26.67 47.24,27.69 UC1.P$46
  Bottom 0.203: v47.24,26.67 44.7,24.13 31.5,24.13 JTAG.6
JTAG-TRST  (via drill 0.33)  (1 unrouted)
  Top 0.203: 30.99,2.29 33.02,2.29 J2.1 | 30.99,2.29 29.46,2.29 RESET.P$2 | v49.28,17.53 49.28,16.51 UC1.P$7 | JTAG.8 32,24.13 32,19.05 JTAG.1 33.02,14.48 R1.2 33.02,13.97 33.02,11.94 30.99,9.91 30.99,2.29
  Bottom 0.203: v49.28,17.53 34.04,17.53 33.53,18.03 JTAG.1
N$1
  Top 0.254: JP1.2 1.52,8.89 1.52,11.43 3.56,13.46 D2.A 4.06,13.46 9.65,7.87 10.67,7.87 BAR.PWR
N$2
  Top 0.203: 48.77,9.91 46.74,9.91 OSC.1 | 48.77,9.91 49.28,9.91 C9.1 | 48.77,9.91 48.77,16 UC1.P$6
N$3  (via drill 0.33)
  Top 0.203: v15.24,48.51 15.24,47.5 IC4.P$8 | v21.34,37.34 20.32,38.35 20.32,38.86 | 20.32,38.86 20.32,40.39 R20.2 | 20.32,38.86 17.78,38.86 17.27,39.37 17.27,40.39 18.29,41.4 R16.1
  Bottom 0.203: v15.24,48.51 20.83,42.93 20.83,37.34 v21.34,37.34
N$5  (via drill 0.33)
  Top 0.203: v10.16,13.97 7.11,13.97 D2.C
  Route15 0.61: PWR.8 22.86,23.17
  Bottom 0.203: v10.16,13.97 16.76,20.57 20.32,20.57 22.35,22.61 PWR.8
N$6
  Top 0.203: C6.1 40.64,7.87 42.67,7.87 OSC.3 43.18,7.37 44.7,8.89 44.7,10.92 48.26,14.48 48.26,16 UC1.P$5
N$7
  Top 0.203: D1.A 20.83,45.47 R5.2
N$8
  Top 0.203: R11.2 14.22,18.54 14.73,19.05 14.73,19.56 Q1.2
N$9
  Top 0.203: R10.2 13.21,17.02 13.21,16 R6.1 13.72,16 14.22,15.49 15.75,15.49 Q2.3 16.26,15.49 17.27,16.51 17.27,19.56 Q1.1
N$10
  Top 0.203: R7.1 13.21,14.48 13.21,13.46 R9.2 14.73,13.46 Q2.1
N$11
  Top 0.203: 13.21,23.62 13.21,22.61 R12.1 | 13.21,23.62 13.21,31.75 20.83,31.75 21.34,31.24 21.34,29.21 22.86,29.21 23.88,30.23 47.24,30.23 48.26,29.21 48.26,28.19 UC1.P$44 | 13.21,23.62 C7.1
N$12  (via drill 0.33)
  Top 0.203: 14.22,21.08 13.72,20.57 13.72,20.07 C8.1 | v14.73,21.59 14.22,21.08 | R11.1 v10.16,18.54 | 14.22,21.08 R13.1 | v28.96,29.21 28.96,29.72 47.24,29.72 47.75,29.21 47.75,28.19 UC1.P$45
  gndplane 0.203: v10.16,18.54 13.21,21.59 v14.73,21.59
  Bottom 0.203: v28.96,29.21 23.88,24.13 22.35,24.13 21.34,23.11 21.34,22.1 20.83,22.1 20.32,21.59 v14.73,21.59
N$13
  Top 0.203: 14.22,44.45 14.73,44.45 IC4.P$2 | 14.22,44.45 13.72,43.94 13.72,39.88 22.35,31.24 22.35,30.73 PWR.2 | 14.22,44.45 IC4.P$1
N$16  (via drill 0.33)
  Top 0.254: 14.22,47.5 14.73,47.5 IC4.P$9 | 12.7,49.02 14.22,47.5 | 12.7,49.02 12.7,50.04 C16.1 | 14.22,47.5 IC4.P$10 | 12.7,49.02 v11.18,47.5 8.64,44.96 8.13,44.96 8.13,45.97 LIPO.2
  Route15 0.254: 11.38,47.4 v11.18,47.5
  Route15 0.406: 19.3,29.46 21.57,29.46 PWR.4
  Route15 0.61: 11.38,47.4 11.38,33.83 15.75,29.46 19.3,29.46
N$18  (via drill 0.33)
  Top 0.203: v53.34,34.8 55.37,34.8 R14.1
  Bottom 0.203: 52.83,34.29 51.82,33.27 50.8,33.27 49.78,32.26 IC3.TCK | 52.83,34.29 v53.34,34.8 | 52.83,34.29 65.02,34.29 65.02,32.26 IC3.GND16
N$19
  Top 0.203: IC4.P$6 16.26,47.5 16.26,50.04 15.75,50.55 R19.2 15.24,50.04 C16.2
N$20
  Top 0.203: D4.C 23.37,42.42 21.84,42.42 21.34,42.93 21.34,43.43 20.83,43.94 R18.2
N$21
  Top 0.203: D3.C 21.84,40.89 21.84,41.91 20.83,42.93 R17.2
N$22
  Top 0.203: IC4.P$3 15.24,44.45 15.24,43.43 16.26,42.42 17.78,42.42 18.29,42.93 R17.1
N$23
  Top 0.203: IC4.P$4 15.75,44.45 15.75,43.43 16.26,42.93 17.27,42.93 18.29,43.94 R18.1
N$25
  Top 0.254: RESET.P$1 28.96,3.81 25.4,3.81 RESET.P$3 24.89,3.81 22.86,3.81 R3.1
N$26
  Top 0.203: R2.2 35.05,13.46 36.58,13.46 BUT.P$4 37.08,13.46 40.64,13.46 BUT.P$2
N$27  (via drill 0.33)
  Top 0.203: v55.88,30.73 54.86,30.73 R15.1
  Bottom 0.203: v55.88,30.73 56.9,31.75 56.9,32.26 56.39,32.26 IC3.JRST
SD_CLK  (1 unrouted)
SD_CMD  (1 unrouted)
SD_D0  (via drill 0.33)
  Top 0.203: v50.8,26.67 50.8,27.69 UC1.P$39 | v6.6,39.37 5.59,40.39 U1.7
  Bottom 0.203: v50.8,26.67 47.24,30.23 25.91,30.23 16.76,39.37 v6.6,39.37
SD_D1  (via drill 0.33)
  Top 0.203: v49.78,26.67 50.29,27.18 50.29,27.69 UC1.P$40 | v9.65,38.35 6.6,41.4 5.59,41.4 U1.8
  gndplane 0.203: v49.78,26.67 38.1,38.35 v9.65,38.35
SD_D2  (1 unrouted)
SD_D3  (1 unrouted)
USBDM
  Top 0.203: R12.2 11.18,22.1 8.13,22.1 8.13,22.61 X1.D-
USBDP
  Top 0.203: R13.2 9.65,21.08 9.14,21.59 X1.D+
VCC  (via drill 0.33)  (3 unrouted)
  Top 0.203: C3.1 57.91,27.69 v56.9,28.7 56.9,35.81 55.88,36.83 R14.2 | IC2.2 25.4,11.43 v25.4,9.91 25.4,8.38 C12.+ | C5.1 60.45,16.51 59.94,16 59.94,13.97 C13.1 59.44,13.97 57.91,13.97 v57.91,13.46 | 46.23,16.51 44.7,14.99 C4.1 | v45.21,28.19 46.23,28.19 UC1.P$48 | v45.21,28.19 43.69,28.19 C2.1 | D4.A 24.89,41.91 24.89,40.89 D3.A v26.42,40.89 | v10.16,14.99 11.18,14.99 R7.2 | v30.99,15.49 30.99,14.48 R1.1 | v34.54,16 34.54,14.99 R2.1 | v61.47,36.83 61.47,35.81 C14.1 | v14.73,17.53 15.75,17.53 Q1.3 | v3.56,36.83 5.08,36.83 U1.4 | 46.23,16.51 46.23,26.16 45.21,27.18 v45.21,28.19 | 46.23,16.51 UC1.P$1
  Route15 0.203: v57.91,13.46 58.04,13.46
  Bottom 0.203: v57.91,13.46 55.37,13.46 55.37,11.43 IC3.VDD33_29 | v64.01,30.73 65.53,30.73 66.55,31.75 IC3.VDD33_17
  pour Route15 (isolate 0.254): 35.31,11.18 51.05,11.18 51.05,15.49 58.04,15.49 58.04,12.7 64.52,12.7 64.39,37.72 64.39,47.12 21.59,47.24 21.59,53.21 0.38,53.21 0.64,0.64 36.7,0.89 36.7,4.06 34.42,5.71 34.42,10.29
VDD  (via drill 0.33)
  Top 0.203: v30.48,10.41 30.48,11.43 IC1.2 | J2.3 38.1,3.3 37.59,3.81 37.59,4.32 33.53,8.38 C10.+ | v54.36,12.95 54.36,13.97 C1.1
  Top 0.254: UC1.P$13 52.31,15.25 52.58,14.99 54.36,14.99 54.61,14.73 54.61,13.8 C1.1
  Route15 0.813: J2.3 38.1,5.84 38.86,6.6 38.86,8.64 38.61,8.64 36.17,9.45
  Bottom 0.203: v30.48,10.41 37.59,3.3 37.59,2.79 J2.3
  pour Route15: 38.1,10.41 35.31,10.41 35.31,8.51 38.86,4.7 50.16,4.7 50.16,1.52 64.77,1.52 64.77,3.56 68.33,5.84 68.33,17.27 65.02,17.27 65.02,12.19 57.02,12.19 57.02,14.1 51.69,14.1 51.69,5.97 42.55,5.97
VIN  (via drill 0.33)
  Top 0.203: v21.84,39.88 21.84,40.39 20.83,41.4 R16.2 | PWR.1 19.81,30.23 19.3,29.72 19.3,29.21 19.81,28.7 19.81,28.19 PWR.3 21.34,27.18 21.34,26.67 PWR.5 19.81,25.15 19.3,24.64 19.3,24.13 19.81,23.62 19.81,23.11 PWR.7 20.32,22.61 21.84,21.08 21.84,17.02 C15.1 21.84,16.51 21.84,13.97 | 21.84,13.97 24.38,13.97 IC2.3 24.89,13.97 28.45,13.97 | 28.45,13.97 29.46,13.97 IC1.3 | 21.84,13.97 21.84,8.38 C11.+ | 28.45,13.97 v28.45,13.46
  Route15 0.813: PWR.1 20.31,38.35 v21.84,39.88 | PWR.7 20.31,14.23 20.32,14.22
  Bottom 0.203: J2.6 35.05,13.46 v28.45,13.46
WI_MISO  (via drill 0.33)
  Top 0.203: v52.83,18.03 52.83,27.69 UC1.P$35
  Bottom 0.203: v52.83,18.03 52.83,13.46 52.32,13.46 51.82,12.95 51.82,11.43 51.31,11.43 IC3.SDO
WI_MOSI  (via drill 0.33)
  Top 0.203: v50.8,18.03 50.8,24.13 52.32,25.65 52.32,27.69 UC1.P$36
  Bottom 0.203: v50.8,18.03 48.26,15.49 48.26,12.45 47.24,11.43 IC3.SDI
WI_SCK  (via drill 0.33)
  Top 0.203: v53.85,20.07 53.34,20.57 53.34,27.69 UC1.P$34
  Bottom 0.203: v53.85,20.07 51.82,18.03 51.82,13.46 49.78,13.46 48.77,12.45 48.77,11.43 IC3.SCK
WI_SS_N  (via drill 0.33)
  Top 0.203: v54.36,21.08 54.36,27.18 53.85,27.69 UC1.P$33
  Bottom 0.203: v54.36,21.08 62.48,12.95 62.48,11.43 IC3.SS_N

### Text on the board
tPlace: 14 | GND | 13 | 12 | 11 | 10 | 9 | 8 | 7 | 6 | 5 | 4 | 3 | 2 | 1 | 0 | 3.7V LiPo | PWM | PWM | PWM | PWM | PWM | PWM | PWM | PWM | PWM | PWM | PWM | PWM | AIN | AIN | AIN | AIN | RX1 | TX1 | AIN | AIN | AIN | D1 | TX2 | RX2 | DONE | CHRG | CHRG | PWRSEL | BAT | STM32 | USB | EXT | JTAG | EXT | 7-18V | + | AIN | AIN | AIN | AIN | AIN | AIN | RST | VCC | VDDA | GND | Vin | 15 | 16 | 17 | 18 | 19 | 20 | -
bPlace: GND | 14 | 13 | 12 | 11 | 10 | 9 | 8 | 7 | 6 | 5 | 4 | 3 | 3 | 2 | 1 | 0 | ck | miso | mosi | ss | SPI1 | I2C1-SDA | I2C1-SCL | 39 | 42 | RST | VCC | VDDA | GND | Vin | 15 | AIN | 16 | AIN | 17 | AIN | 18 | AIN | 19 | AIN | 20 | AIN
tValues: DNP | DNP | JST-Right Angle | DNP | DNP | DNP | DNP